# EAGLE design logicBlocks-NOT (EAGLE 6.6.0)
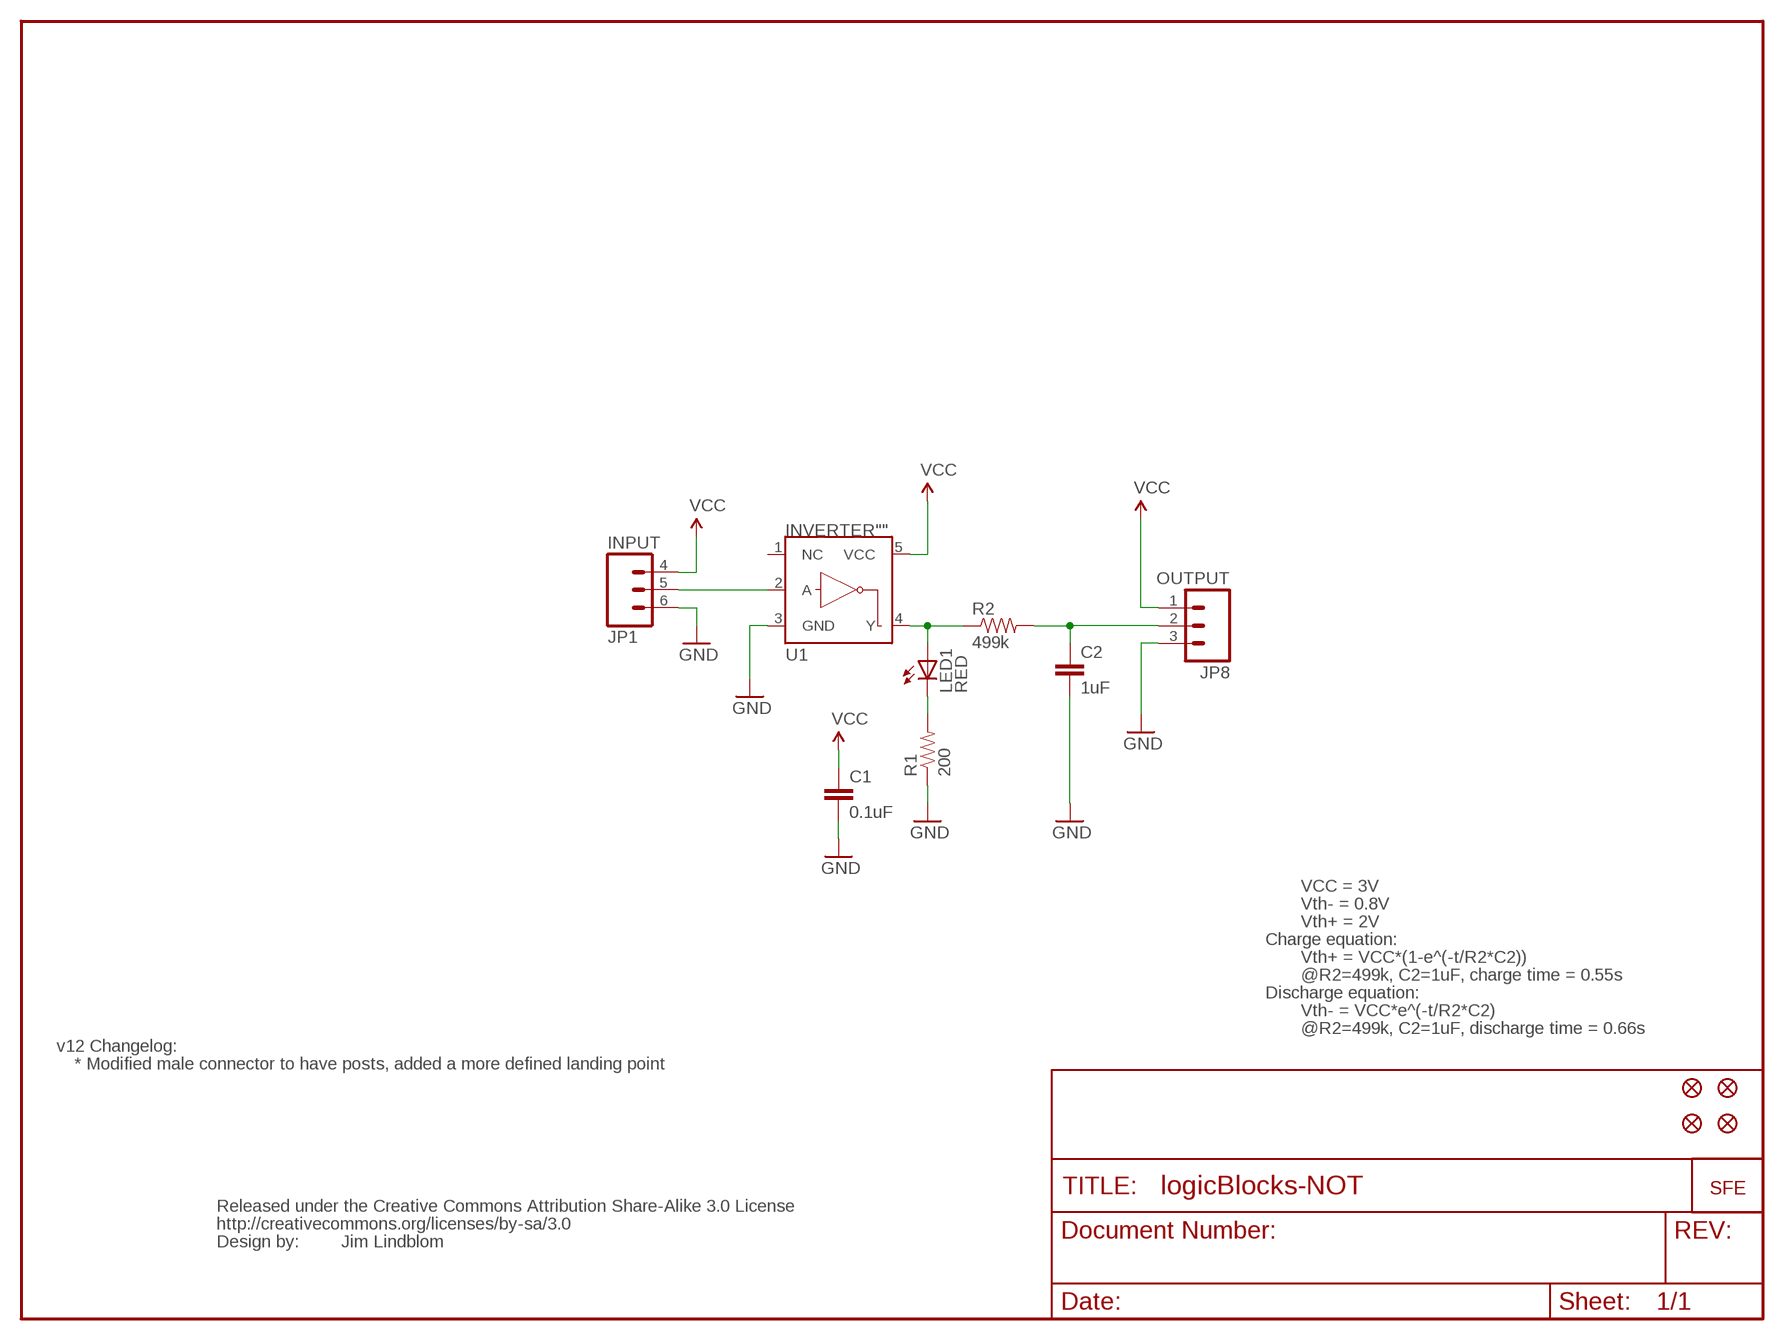
[diagram p0: schematic, sheet 1]

## Parts
C1  0.1uF  CAP0402-CAP  [0402-CAP]
C2  1uF  CAP0402-CAP  [0402-CAP]
FID1  FIDUCIAL1X2  [FIDUCIAL-1X2]
FID2  FIDUCIAL1X2  [FIDUCIAL-1X2]
FID3  FIDUCIAL1X2  [FIDUCIAL-1X2]
FID4  FIDUCIAL1X2  [FIDUCIAL-1X2]
JP1  INPUT  M03SMD-RA-FEMALE  [1X03-SMD-FEMALE]
JP4  LOGO-SFESK  [SFE-LOGO-FLAME]
JP8  OUTPUT  M03SMD_RA_MALE_POST  [1X03_SMD_RA_MALE_POST]
LED1  RED  LED1206  [LED-1206]
R1  200  RESISTOR0402-RES  [0402-RES]
R2  499k  RESISTOR0402-RES  [0402-RES]
U1  INVERTER""  [SC70]
U$2  CREATIVE_COMMONS  [CREATIVE_COMMONS]

## Nets
GND: C1.2 C2.2 JP1.6 JP8.3 R1.1 U1.3(GND)
N$1: LED1.C R1.2
N$2: JP1.5 U1.2(A)
N$3: LED1.A R2.1 U1.4(Y)
N$4: C2.1 JP8.2 R2.2
VCC: C1.1 JP1.4 JP8.1 U1.5(VCC)
Unconnected: U1.1(NC)

## Notes on the sheet
- VCC = 3V
- Vth- = 0.8V
- Vth+ = 2V
- Charge equation:
- Vth+ = VCC*(1-e^(-t/R2*C2))
- @R2=499k, C2=1uF, charge time = 0.55s
- Discharge equation:
- Vth- = VCC*e^(-t/R2*C2)
- @R2=499k, C2=1uF, discharge time = 0.66s
- v12 Changelog:
- * Modified male connector to have posts, added a more defined landing point
- Jim Lindblom

## Library data of the parts
C1 C2 = SparkFun:CAP: Capacitor Standard 0603 ceramic capacitor, and 0.1" leaded capacitor.
FID1-FID4 = SparkFun-Aesthetics:FIDUCIAL: Fiducial Alignment Points Various fiducial points for machine vision alignment.
JP1 = SparkFun:M03: Header 3 Standard 3-pin 0.1" header. Use with straight break away headers (SKU : PRT-00116), right angle break away headers (PRT-00553), swiss pins (PRT-00743), machine pins (PRT-00117), and female headers (PRT-00115). Molex polarized connector foot print use with SKU : PRT-08232 with associated crimp pins and housings.
JP4 = SparkFun:LOGO-SFE: Spark Fun Electronics PCB Logo This is the standard Spark Fun Electronics PCB logo.
JP8 = SparkFun-Connectors:M03: Header 3 Standard 3-pin 0.1" header. Use with straight break away headers (SKU : PRT-00116), right angle break away headers (PRT-00553), swiss pins (PRT-00743), machine pins (PRT-00117), and female headers (PRT-00115). Molex polarized connector foot print use with SKU : PRT-08232 with associated crimp pins and housings.
LED1 = SparkFun:LED: LEDs Standard schematic elements and footprints for 5mm, 3mm, 1206, and 0603 sized LEDs. 5mm - Spark Fun Electronics SKU : COM-00529 (and others)
R1 R2 = SparkFun:RESISTOR: Resistor Basic schematic elements and footprints for 0603, 1206, and PTH resistors.
U1 = SparkFun:INVERTER: Single inverter, SOT23-5
U$2 = SparkFun:CREATIVE_COMMONS

## Board
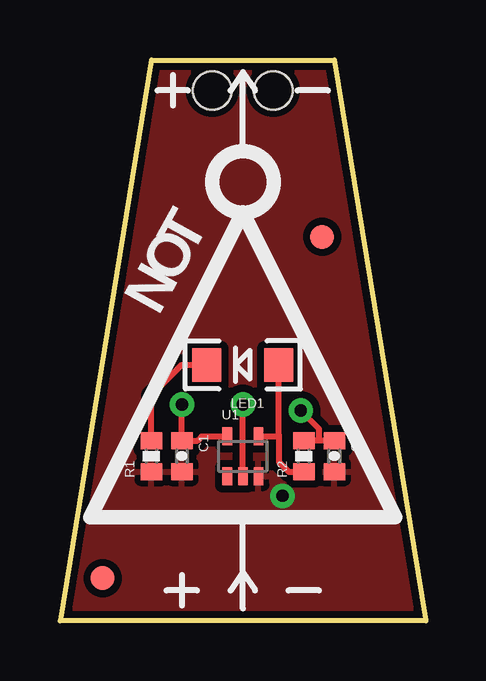
[diagram p1: board, top side]
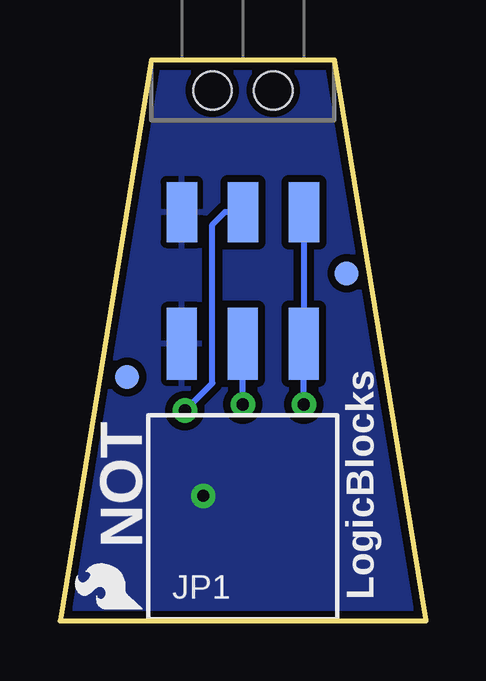
[diagram p2: board, bottom side, seen from below]

Size 15.24 x 23.37 mm. Coordinates in mm from the lower left corner, seen from the top.
Outline: 3.81,23.37 11.43,23.37 15.24,0 0,0 3.81,23.37
Copper layers (1*16): Top 0.035mm / dielectric 1.5mm / Bottom 0.035mm
Design rules "default": minimum track width 8mil, minimum drill 20mil, track to track 8mil, track to pad 8mil, pad to pad 8mil, via to via 8mil, smd to smd 8mil, copper to edge 8mil, drill to drill 8mil, minimum pad ring 12mil, minimum via ring 10mil, stop-mask expansion 4mil, vias tented up to drill 20mil, thermal gap 10mil

### Footprints (pad centres in the part's own frame; a part is rotated, then mirrored left to right if it is on the bottom)
0402-CAP = smd 0.7 x 0.9: 1 -0.65,0; 2 0.65,0
FIDUCIAL-1X2 = smd 1 x 1: 1 0,0
1X03-SMD-FEMALE = smd 1.25 x 3: 4 2.54,7.225; 5 0,7.225; 6 -2.54,7.225
1X03_SMD_RA_MALE_POST = smd 1.27 x 2.5: 1 -2.54,5.07; 2 0,5.07; 3 2.54,5.07 | hole 1.6: -1.27,0; 1.27,0
LED-1206 = smd 1.2 x 1.4: A -1.5,0; C 1.5,0
0402-RES = smd 0.7 x 0.9: 1 -0.65,0; 2 0.65,0
SC70 = smd 0.4 x 0.75: 1 -0.65,-0.825; 2 0,-0.825; 3 0.65,-0.825; 4 0.65,0.825; 5 -0.65,0.825

### Placement (x,y rotation side)
C1  5.08,6.86 270 top
C2  11.43,6.86 270 top
FID1  1.78,1.78 0 top
FID2  10.92,16 0 top
FID3  3.3,14.48 0 bottom
FID4  12.45,10.16 0 bottom
JP1  7.62,4.32 0 bottom
JP4  11.81,0.51 90 bottom
JP8  7.62,22.1 180 bottom
LED1  7.62,10.67 180 top
R1  3.81,6.86 90 top
R2  10.16,6.86 90 top
U1  7.62,6.86 0 top
U$2  0,-8.89 0 top  (outside the outline)

### Tracks (layer width: path | path; a pad name or v marks a point on that pad's centre or on a via)
GND  (via drill 0.51)
  other vias: 9.27,5.21
  pour Top (isolate 0.305): 0,0 3.81,23.37 11.43,23.37 15.24,0
  pour Bottom (isolate 0.305): 0,0 3.81,23.37 11.43,23.37 15.24,0
N$1
  Top 0.254: LED1.C 5.08,10.67 3.81,9.4 R1.2
N$2  (via drill 0.51)
  Top 0.254: U1.2 v7.62,9.02
  Bottom 0.254: v7.62,9.02 JP1.5
N$3
  Top 0.254: 9.12,7.75 9.12,6.63 9.54,6.21 R2.1 | 9.12,7.75 LED1.A | U1.4 9.06,7.68 9.12,7.75
N$4  (via drill 0.51)
  Top 0.254: v10.03,8.76 10.79,8 10.79,7.51 | C2.1 10.79,7.51 | 10.79,7.51 R2.2
  Bottom 0.254: v10.03,8.76 8.89,9.91 8.89,16.51 8.37,17.03 JP8.2
VCC  (via drill 0.51)
  Top 0.254: v5.08,9.02 C1.1 5.73,7.51 5.91,7.68 U1.5
  Bottom 0.254: v5.08,9.02 JP1.4 JP8.1

### Text on the board
tPlace: T | O | N
bPlace: NOT | LogicBlocks